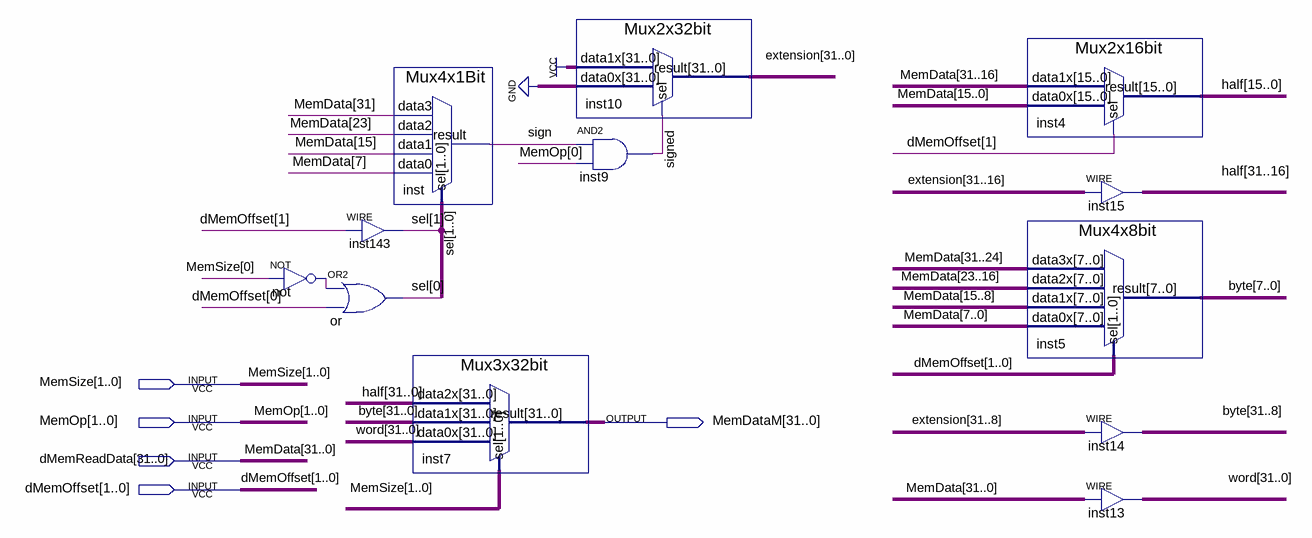
[diagram p0: schematic sheet]
// Quartus schematic LoadBlock.bdf as structural Verilog: 12 symbols, 5 pins
module LoadBlock (
  input  [1:0] MemSize,
  input  [1:0] MemOp,
  input  [31:0] dMemReadData,
  input  [1:0] dMemOffset,
  output [31:0] MemDataM
);

  wire not_out, sign, \signed ;
  wire [1:0] sel;
  wire [31:0] \byte , extension, half, word;

  not \not  (not_out, MemSize[0]);
  assign sel[1] = dMemOffset[1];  // WIRE inst143
  or \or  (sel[0], not_out, dMemOffset[0]);
  Mux4x1Bit inst (
    .data3(dMemReadData[31]), .data2(dMemReadData[23]), .data1(dMemReadData[15]), .data0(dMemReadData[7]),
    .sel(sel), .result(sign));
  Mux3x32bit inst7 (.data2x(half), .data1x(\byte ), .data0x(word), .sel(MemSize), .result(MemDataM));
  Mux2x32bit inst10 (.data1x({32{1'b1}}), .data0x({32{1'b0}}), .sel(\signed ), .result(extension));
  and inst9 (\signed , sign, MemOp[0]);
  Mux2x16bit inst4 (
    .data1x(dMemReadData[31:16]), .data0x(dMemReadData[15:0]), .sel(dMemOffset[1]), .result(half[15:0]));
  Mux4x8bit inst5 (
    .data3x(dMemReadData[31:24]), .data2x(dMemReadData[23:16]), .data1x(dMemReadData[15:8]),
    .data0x(dMemReadData[7:0]), .sel(dMemOffset), .result(\byte [7:0]));
  assign half[31:16] = extension[31:16];  // WIRE inst15
  assign \byte [31:8] = extension[31:8];  // WIRE inst14
  assign word = dMemReadData;  // WIRE inst13

  // Other names for the same wires on the sheet: MemData[31:0] = dMemReadData
endmodule
